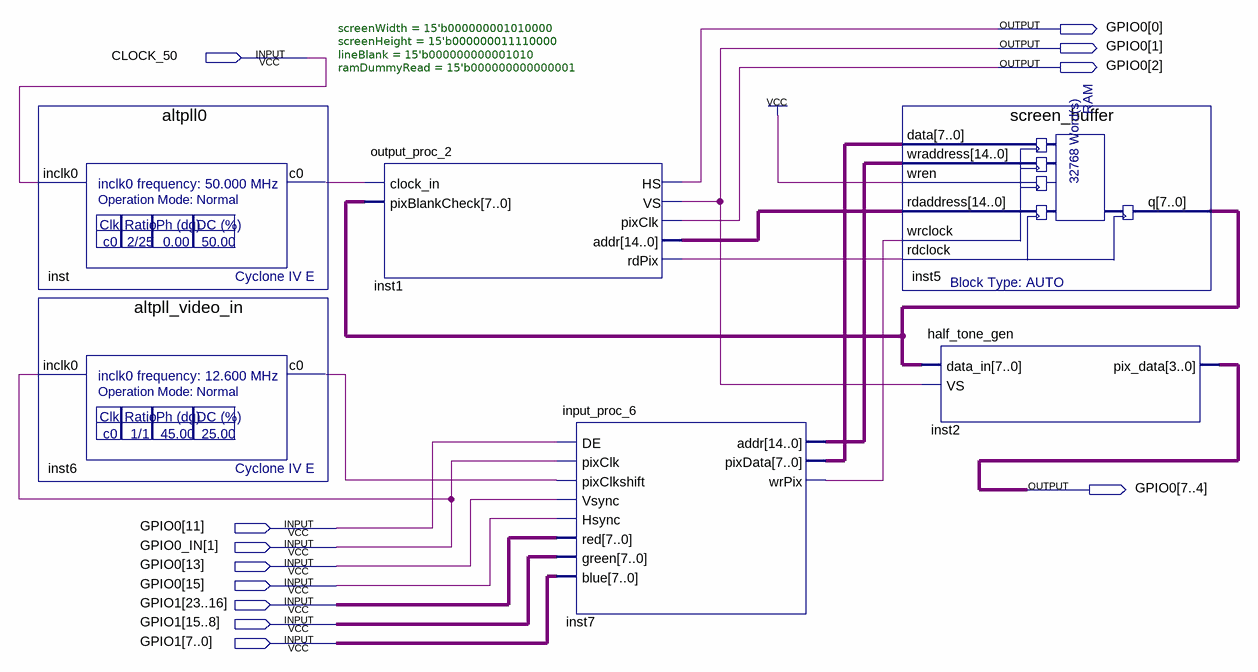
[diagram p0: schematic sheet]
// Quartus schematic screen03.bdf as structural Verilog: 6 symbols, 12 pins
module screen03 (
  input  CLOCK_50,
  inout  [15:0] GPIO0,
  input  [1:1] GPIO0_IN,
  input  [23:0] GPIO1
);

  wire inst1_rdpix, inst6_c0, inst7_wrpix, inst_c0;
  wire [7:0] inst5_q, inst7_pixdata;
  wire [14:0] inst1_addr, inst7_addr;

  altpll0 inst (.inclk0(CLOCK_50), .c0(inst_c0));
  altpll_video_in inst6 (.inclk0(GPIO0_IN[1]), .c0(inst6_c0));
  output_proc_2 #(.screenWidth(15'b000000001010000), .screenHeight(15'b000000011110000), .lineBlank(15'b000000000001010), .ramDummyRead(15'b000000000000001)) inst1 (
    .clock_in(inst_c0), .pixBlankCheck(inst5_q), .HS(GPIO0[0]), .VS(GPIO0[1]), .pixClk(GPIO0[2]),
    .addr(inst1_addr), .rdPix(inst1_rdpix));
  input_proc_6 inst7 (
    .DE(GPIO0[11]), .pixClk(GPIO0_IN[1]), .pixClkshift(inst6_c0), .Vsync(GPIO0[13]), .Hsync(GPIO0[15]),
    .red(GPIO1[23:16]), .green(GPIO1[15:8]), .blue(GPIO1[7:0]), .addr(inst7_addr), .pixData(inst7_pixdata),
    .wrPix(inst7_wrpix));
  screen_buffer inst5 (
    .data(inst7_pixdata), .wraddress(inst7_addr), .wren(1'b1), .rdaddress(inst1_addr), .wrclock(inst7_wrpix),
    .rdclock(inst1_rdpix), .q(inst5_q));
  half_tone_gen inst2 (.data_in(inst5_q), .VS(GPIO0[1]), .pix_data(GPIO0[7:4]));
endmodule
